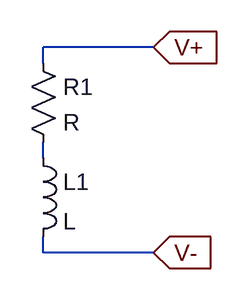
[diagram p0: schematic spkr.asc]
spkr.asc, the LTspice schematic file:
Version 4
SHEET 1 880 680
WIRE 304 80 192 80
WIRE 192 96 192 80
WIRE 192 192 192 176
WIRE 192 288 192 272
WIRE 304 288 192 288
FLAG 304 288 V-
IOPIN 304 288 In
FLAG 304 80 V+
IOPIN 304 80 In
SYMBOL res 176 80 R0
SYMATTR InstName R1
SYMBOL ind 176 176 R0
SYMATTR InstName L1

The netlist it stands for:
* spkr.asc
R1 V+ N001 R
L1 N001 V- L
.backanno
.end